# EAGLE schematic DMX_Transmiter v24 (EAGLE 9.7.0)
CNAME: DMX MASTER/SLAVE Transmitter; CREVISION: Marcel Tresanchez; DESIGNER: Guillermo Morancho Vela

## Sheet 1 of 2
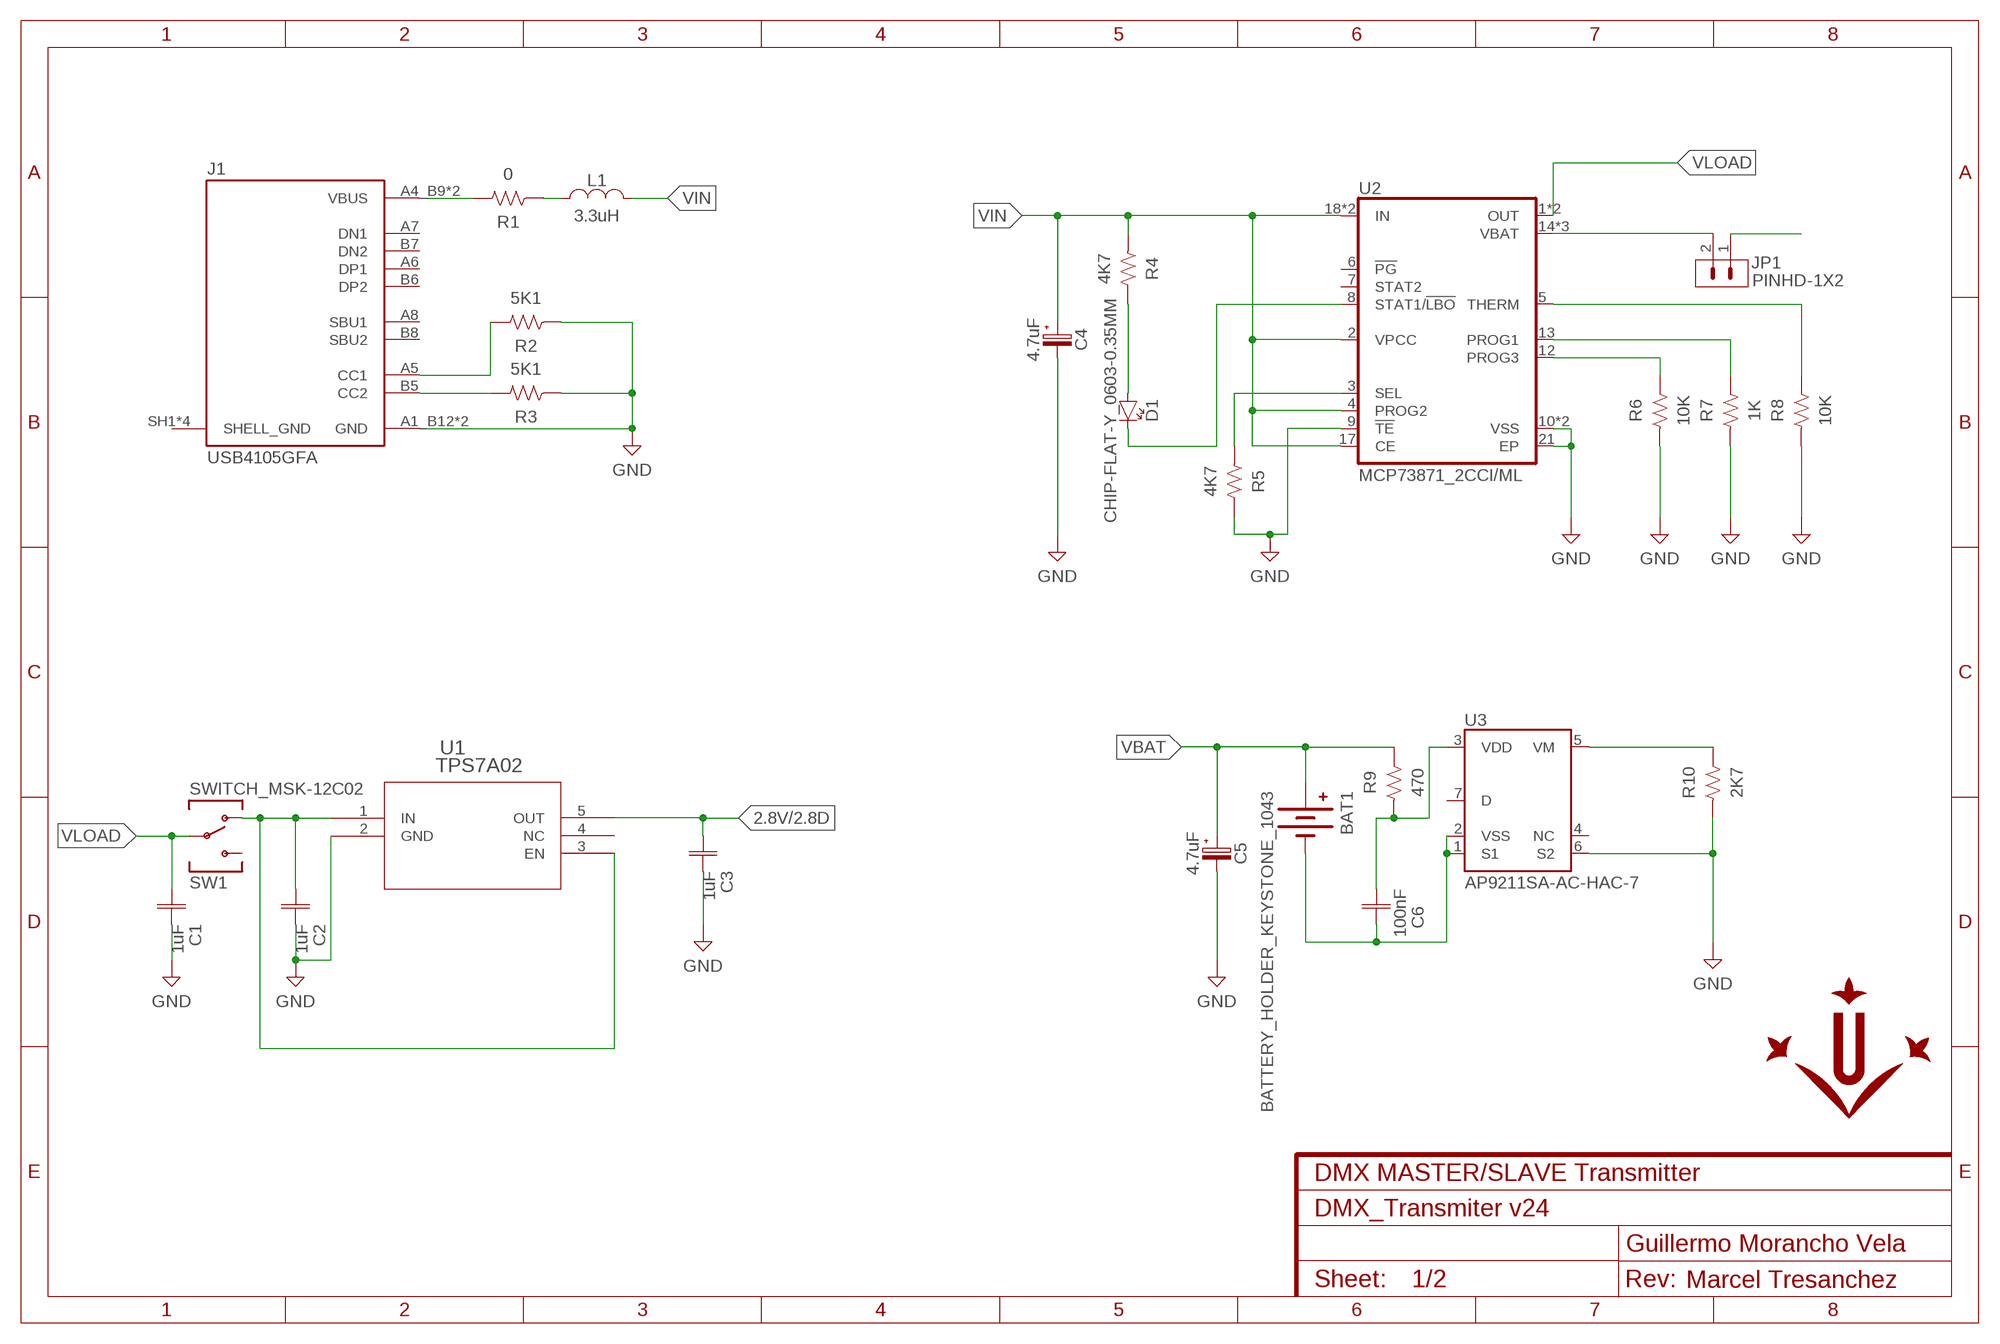
[diagram p0: schematic, sheet 1]

### Parts
BAT1  BATTERY_HOLDER_KEYSTONE_1043  [BH_KEYSTONE_1043]
C1  1uF  C_CHIP-0603(1608-METRIC)  [CAPC1608X85]
C2  1uF  C_CHIP-0603(1608-METRIC)  [CAPC1608X85]
C3  1uF  C_CHIP-0603(1608-METRIC)  [CAPC1608X85]
C4  4.7uF  C-POL_TANTALUM-1206(3216-METRIC)  [CAPMP3216X180N]
C5  4.7uF  C-POL_TANTALUM-1206(3216-METRIC)  [CAPMP3216X180N]
C6  100nF  C_CHIP-0603(1608-METRIC)  [CAPC1608X85]
D1  CHIP-FLAT-Y_0603-0.35MM  [LEDC1608X35N_FLAT-Y]
J1  USB4105GFA  [GCT-USB4105GFA]
JP1  PINHD-1X2  [1X02]
L1  3.3uH  L_CHIP-0603(1608-METRIC)  [INDC1608X95N]
LOGO1  UDL_LOGO_MED  [UDL_LOGO_MED]
R1  0  R-US_CHIP-0603(1608-METRIC)  [RESC1608X60]
R2  5K1  R-US_CHIP-0603(1608-METRIC)  [RESC1608X60]
R3  5K1  R-US_CHIP-0603(1608-METRIC)  [RESC1608X60]
R4  4K7  R-US_CHIP-0603(1608-METRIC)  [RESC1608X60]
R5  4K7  R-US_CHIP-0603(1608-METRIC)  [RESC1608X60]
R6  10K  R-US_CHIP-0603(1608-METRIC)  [RESC1608X60]
R7  1K  R-US_CHIP-0603(1608-METRIC)  [RESC1608X60]
R8  10K  R-US_CHIP-0603(1608-METRIC)  [RESC1608X60]
R9  470  R-US_CHIP-0603(1608-METRIC)  [RESC1608X60]
R10  2K7  R-US_CHIP-0603(1608-METRIC)  [RESC1608X60]
SW1  SWITCH_MSK-12C02  [MSK-12C02]
U1  TPS7A02  [SOT23_DBV_TEX]
U2  MCP73871_2CCI/ML  [QFN50P400X400X100-21N]
U3  AP9211SA-AC-HAC-7  [U-DFN2030-6]

### Nets
2.8V: C3.1 U1.5(OUT) ; also sheet 2
GND: C1.2 C2.2 C3.2 C4.2(-) C5.2(-) J1.A1_B12(GND) J1.B1_A12(GND) R2.1 R3.1 R5.2 R6.1 R7.1 R8.1 R10.1 U1.2(GND) U2.9(!TE) U2.10(VSS) U2.11(VSS) U2.21(EP) U3.6(S2) ; also sheet 2
N$1: J1.B5(CC2) R3.2
N$2: J1.A5(CC1) R2.2
N$3: J1.A4_B9(VBUS) J1.B4_A9(VBUS) R1.2
N$4: L1.1 R1.1
N$5: D1.A R4.2
N$11: D1.C U2.8(STAT1/!LBO)
N$12: R5.1 U2.3(SEL)
N$13: C6.1 R9.1 U3.3(VDD)
N$14: BAT1.2(-) C6.2 U3.1(S1) U3.2(VSS)
N$15: R8.2 U2.5(THERM)
N$16: R7.2 U2.13(PROG1)
N$17: R6.2 U2.12(PROG3)
N$18: R10.2 U3.5(VM)
N$19: JP1.2 U2.14(VBAT) U2.15(VBAT) U2.16(VBAT)
N$21: C2.1 SW1.O U1.1(IN) U1.3(EN)
VBAT: BAT1.1(+) C5.1(+) JP1.1 R9.2
VIN: C4.1(+) L1.2 R4.1 U2.2(VPCC) U2.4(PROG2) U2.17(CE) U2.18(IN) U2.19(IN)
VLOAD: C1.1 SW1.P U2.1(OUT) U2.20(OUT)
Unconnected: J1.A6(DP1) J1.A7(DN1) J1.A8(SBU1) J1.B6(DP2) J1.B7(DN2) J1.B8(SBU2) J1.SH1(SHELL_GND) J1.SH2(SHELL_GND) J1.SH3(SHELL_GND) J1.SH4(SHELL_GND) SW1.S U1.4(NC) U2.6(!PG) U2.7(STAT2) U3.4(NC) U3.7(D)

## Sheet 2 of 2
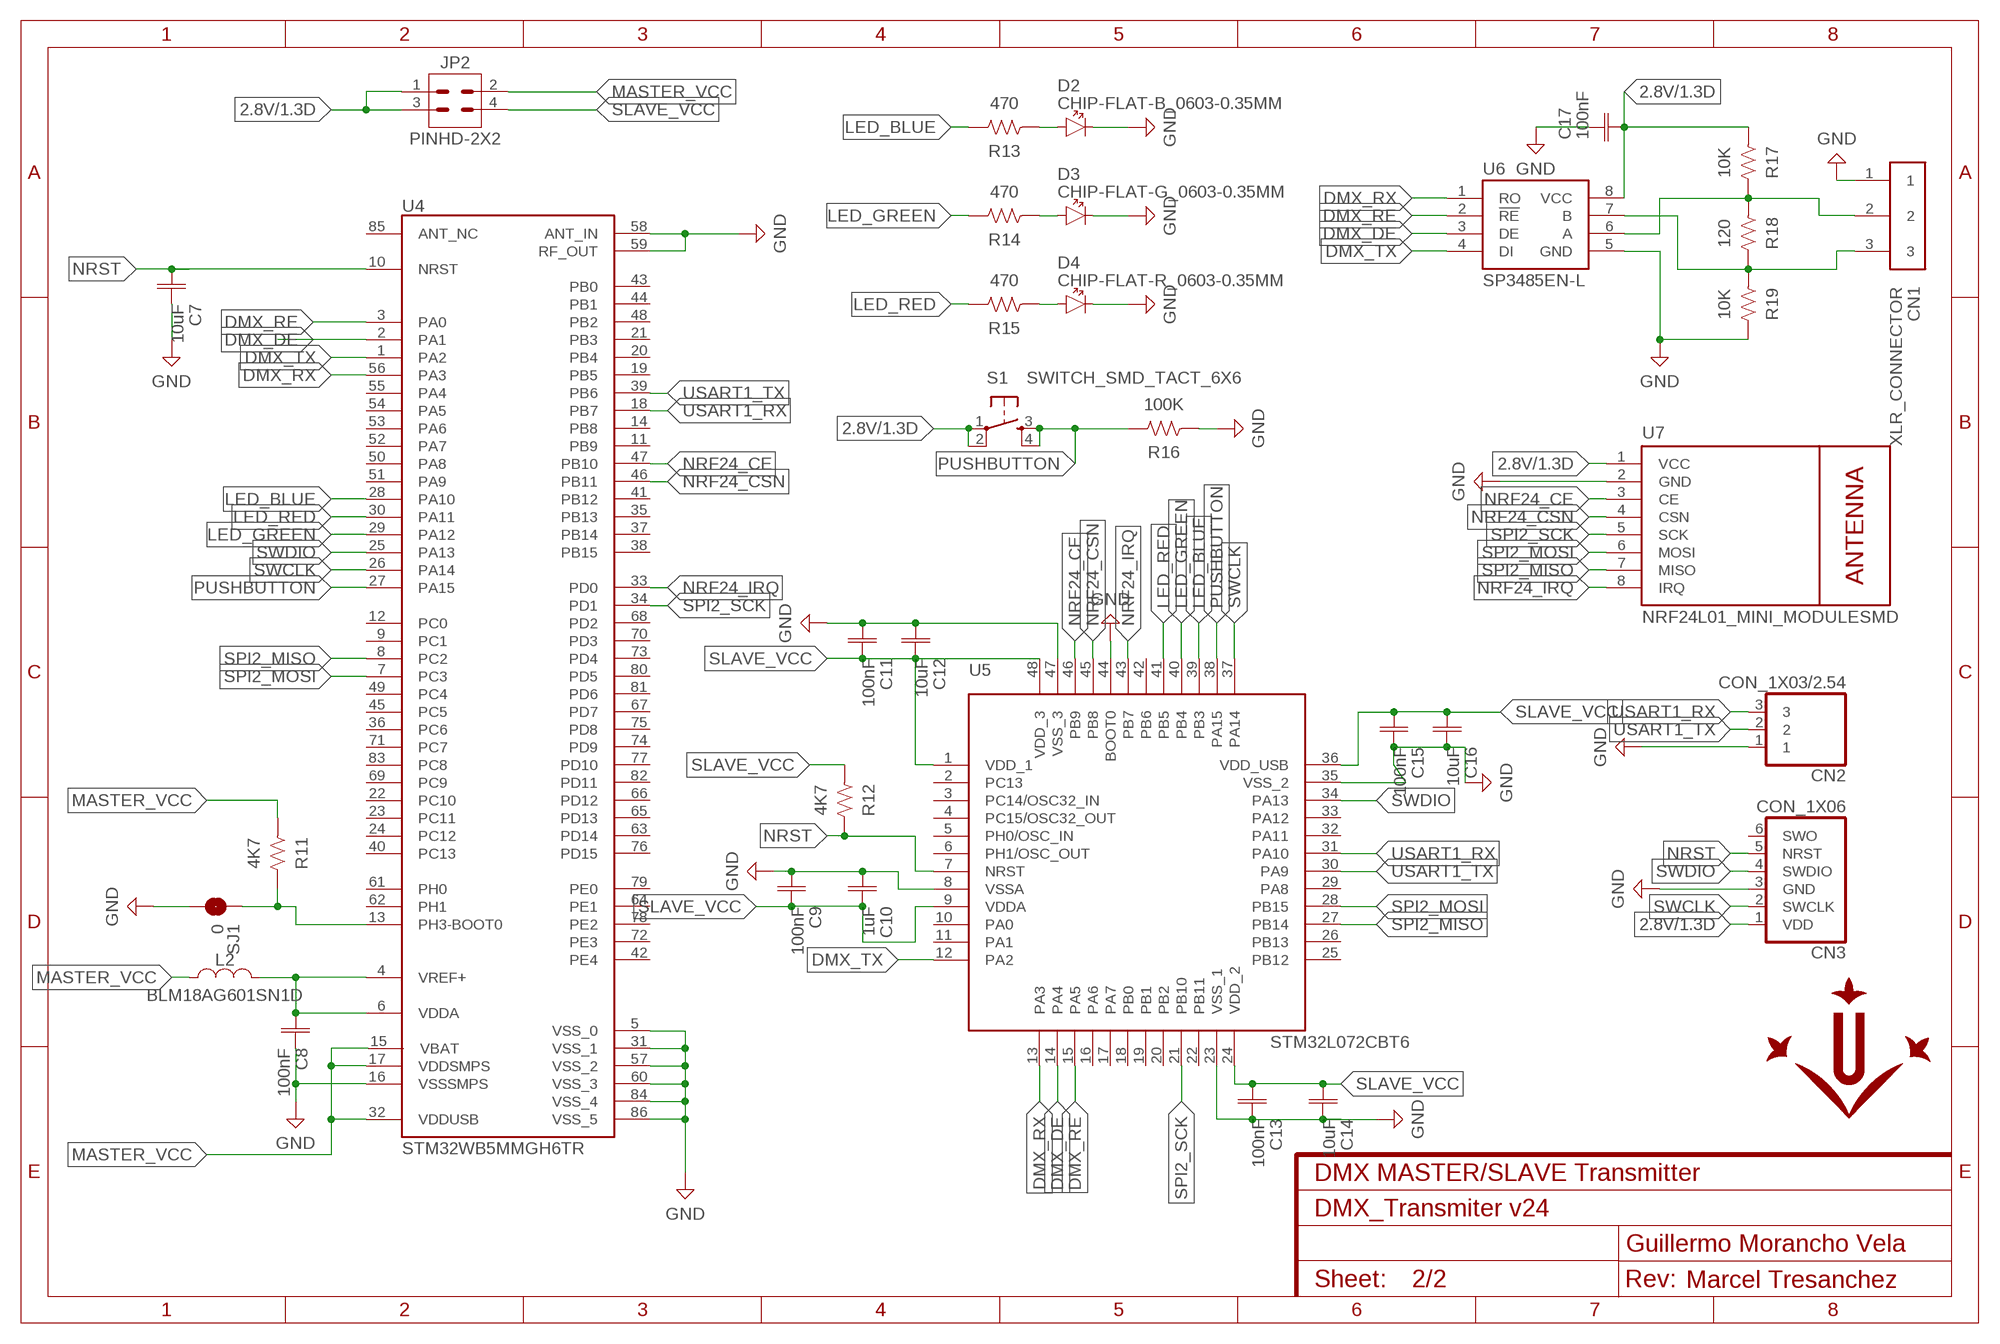
[diagram p1: schematic, sheet 2]

### Parts
C7  10uF  C_CHIP-0603(1608-METRIC)  [CAPC1608X85]
C8  100nF  C_CHIP-0603(1608-METRIC)  [CAPC1608X85]
C9  100nF  C_CHIP-0603(1608-METRIC)  [CAPC1608X85]
C10  1uF  C_CHIP-0603(1608-METRIC)  [CAPC1608X85]
C11  100nF  C_CHIP-0603(1608-METRIC)  [CAPC1608X85]
C12  10uF  C_CHIP-0603(1608-METRIC)  [CAPC1608X85]
C13  100nF  C_CHIP-0603(1608-METRIC)  [CAPC1608X85]
C14  10uF  C_CHIP-0603(1608-METRIC)  [CAPC1608X85]
C15  100nF  C_CHIP-0603(1608-METRIC)  [CAPC1608X85]
C16  10uF  C_CHIP-0603(1608-METRIC)  [CAPC1608X85]
C17  100nF  C_CHIP-0603(1608-METRIC)  [CAPC1608X85]
CN1  XLR_CONNECTOR  [XLR_PINS]
CN2  CON_1X03/2.54  [CON_1X03_2.54]
CN3  CON_1X06  CON_SWD_STM32_2.54  [CON_1X06_2.54]
D2  CHIP-FLAT-B_0603-0.35MM  [LEDC1608X35N_FLAT-B]
D3  CHIP-FLAT-G_0603-0.35MM  [LEDC1608X35N_FLAT-G]
D4  CHIP-FLAT-R_0603-0.35MM  [LEDC1608X35N_FLAT-R]
JP2  PINHD-2X2  [2X02]
L2  BLM18AG601SN1D  L_CHIP-0603(1608-METRIC)  [INDC1608X95N]
LOGO2  UDL_LOGO_SMALL  [UDL_LOGO_SMALL]
R11  4K7  R-US_CHIP-0603(1608-METRIC)  [RESC1608X60]
R12  4K7  R-US_CHIP-0603(1608-METRIC)  [RESC1608X60]
R13  470  R-US_CHIP-0603(1608-METRIC)  [RESC1608X60]
R14  470  R-US_CHIP-0603(1608-METRIC)  [RESC1608X60]
R15  470  R-US_CHIP-0603(1608-METRIC)  [RESC1608X60]
R16  100K  R-US_CHIP-0603(1608-METRIC)  [RESC1608X60]
R17  10K  R-US_CHIP-0603(1608-METRIC)  [RESC1608X60]
R18  120  R-US_CHIP-0603(1608-METRIC)  [RESC1608X60]
R19  10K  R-US_CHIP-0603(1608-METRIC)  [RESC1608X60]
S1  SWITCH_SMD_TACT_6X6  [SWITCH_6X6X7.3]
SJ1  0  SOLDER_JUMPER_SMT_2_S_OFF  [SOLDER_JUMPER_2_SMALL_OFF]
U4  STM32WB5MMGH6TR  [SIP-LGA86]
U5  STM32L072CBT6  [QFP50P900X900X160-48N]
U6  SP3485EN-L  [SOIC127P600X175-8N]
U7  NRF24L01_MINI_MODULESMD  [NRF24L01_MINI_MODULE]

### Nets
2.8V: C17.1 CN3.1(VDD) JP2.1 JP2.3 R17.1 S1.1 S1.2 U6.8(VCC) U7.1(VCC) ; also sheet 1
A: CN1.2 R17.2 R18.1 U6.6(A)
B: CN1.3 R18.2 R19.1 U6.7(B)
DMX_DE: U4.2(PA1) U5.14(PA4) U6.3(DE)
DMX_RE: U4.3(PA0) U5.15(PA5) U6.2(!RE)
DMX_RX: U4.56(PA3) U5.13(PA3) U6.1(RO)
DMX_TX: U4.1(PA2) U5.12(PA2) U6.4(DI)
GND: C7.2 C8.2 C9.1 C10.1 C11.1 C12.1 C13.2 C14.2 C15.2 C16.2 C17.2 CN1.1 CN2.1 CN3.3(GND) D2.C D3.C D4.C R16.1 R19.2 SJ1.2 U4.5(VSS_0) U4.16(VSSSMPS) U4.31(VSS_1) U4.57(VSS_2) U4.58(ANT_IN) U4.59(RF_OUT) U4.60(VSS_3) U4.84(VSS_4) U4.86(VSS_5) U5.8(VSSA) U5.23(VSS_1) U5.35(VSS_2) U5.44(BOOT0) U5.47(VSS_3) U6.5(GND) U7.2(GND) ; also sheet 1
LED_BLUE: R13.2 U4.28(PA10) U5.39(PB3)
LED_GREEN: R14.2 U4.29(PA12) U5.40(PB4)
LED_RED: R15.2 U4.30(PA11) U5.41(PB5)
MASTER_VCC: JP2.2 L2.1 R11.1 U4.15(VBAT) U4.17(VDDSMPS) U4.32(VDDUSB)
N$6: C8.1 L2.2 U4.4(VREF+) U4.6(VDDA)
N$7: R11.2 SJ1.1 U4.13(PH3-BOOT0)
N$8: D2.A R13.1
N$9: D3.A R14.1
N$10: D4.A R15.1
NRF24_CE: U4.47(PB10) U5.46(PB9) U7.3(CE)
NRF24_CSN: U4.46(PB11) U5.45(PB8) U7.4(CSN)
NRF24_IRQ: U4.33(PD0) U5.43(PB7) U7.8(IRQ)
NRST: C7.1 CN3.5(NRST) R12.2 U4.10(NRST) U5.7(NRST)
PUSHBUTTON: R16.2 S1.3 S1.4 U4.27(PA15) U5.38(PA15)
SLAVE_VCC: C9.2 C10.2 C11.2 C12.2 C13.1 C14.1 C15.1 C16.1 JP2.4 R12.1 U5.1(VDD_1) U5.9(VDDA) U5.24(VDD_2) U5.36(VDD_USB) U5.48(VDD_3)
SPI2_MISO: U4.8(PC2) U5.27(PB14) U7.7(MISO)
SPI2_MOSI: U4.7(PC3) U5.28(PB15) U7.6(MOSI)
SPI2_SCK: U4.34(PD1) U5.21(PB10) U7.5(SCK)
SWCLK: CN3.2(SWCLK) U4.26(PA14) U5.37(PA14)
SWDIO: CN3.4(SWDIO) U4.25(PA13) U5.34(PA13)
USART1_RX: CN2.3 U4.18(PB7) U5.31(PA10)
USART1_TX: CN2.2 U4.39(PB6) U5.30(PA9)
Unconnected: CN3.6(SWO) U4.9(PC1) U4.11(PB9) U4.12(PC0) U4.14(PB8) U4.19(PB5) U4.20(PB4) U4.21(PB3) U4.22(PC10) U4.23(PC11) U4.24(PC12) U4.35(PB13) U4.36(PC6) U4.37(PB14) U4.38(PB15) U4.40(PC13) U4.41(PB12) U4.42(PE4) U4.43(PB0) U4.44(PB1) U4.45(PC5) U4.48(PB2) U4.49(PC4) U4.50(PA8) U4.51(PA9) U4.52(PA7) U4.53(PA6) U4.54(PA5) U4.55(PA4) U4.61(PH0) U4.62(PH1) U4.63(PD14) U4.64(PE1) U4.65(PD13) U4.66(PD12) U4.67(PD7) U4.68(PD2) U4.69(PC9) U4.70(PD3) U4.71(PC7) U4.72(PE3) U4.73(PD4) U4.74(PD9) U4.75(PD8) U4.76(PD15) U4.77(PD10) U4.78(PE2) U4.79(PE0) U4.80(PD5) U4.81(PD6) U4.82(PD11) U4.83(PC8) U4.85(ANT_NC) U5.2(PC13) U5.3(PC14/OSC32_IN) U5.4(PC15/OSC32_OUT) U5.5(PH0/OSC_IN) U5.6(PH1/OSC_OUT) U5.10(PA0) U5.11(PA1) U5.16(PA6) U5.17(PA7) U5.18(PB0) U5.19(PB1) U5.20(PB2) U5.22(PB11) U5.25(PB12) U5.26(PB13) U5.29(PA8) U5.32(PA11) U5.33(PA12) U5.42(PB6)

## Library data of the parts
BAT1 = Marcel-SystemsIntegration-24-25:BATTERY_HOLDER_KEYSTONE_1043: KEYSTONE - 1043 - BATTERY HOLDER, 18650, TH Source: Datasheet <http://www.keyelco.com/product-pdf.cfm?p=919>; DESCRIPTION: KEYSTONE - 1043 - BATTERY HOLDER, 18650, TH; HEIGHT: 14.86mm; MANUFACTURER_NAME: Keystone Electronics; MANUFACTURER_PART_NUMBER: 1043; MOUSER_PART_NUMBER: 534-1043; MOUSER_PRICE-STOCK: https://www.mouser.co.uk/ProductDetail/Keystone-Electronics/1043?qs=%2F7TOpeL5Mz6j%2FnxeOA1rsg%3D%3D
C1-C3 C6-C17 = Capacitor:C: Capacitor - Generic; CATEGORY: Capacitor; PACKAGE_SIZE: 0603; PACKAGE_TYPE: Surface Mount; SUBCATEGORY: Ceramic Capacitors; TYPE: MLCC
C4 C5 = Capacitor:C-POL: Capacitor Polarised - Generic; CATEGORY: Capacitor; PACKAGE_SIZE: 1206; PACKAGE_TYPE: Surface Mount; SUBCATEGORY: Tantalum Capacitors; TYPE: Polymer Capacitors
CN1 = Library_projecte:XLR_CONNECTOR
CN2 = Marcel-SystemsIntegration-24-25:CON_1X03: 1x03 Connector
CN3 = Marcel-SystemsIntegration-24-25:CON_SWD_STM32: STM32 SWD Connector for programming
D1 = LED:CHIP-FLAT-Y: Yellow LED - Generic; CATEGORY: LED; COLOR: Yellow; DESCRIPTION: Yellow LED Indication 0603 (1608 Metric); PACKAGE_SIZE: 0603; PACKAGE_TYPE: Surface Mount; SUBCATEGORY: Chip LED; TYPE: Square with Flat Top
D2 = LED:CHIP-FLAT-B: Blue LED - Generic; CATEGORY: LED; COLOR: Blue; DESCRIPTION: Blue LED Indication 0603 (1608 Metric); PACKAGE_SIZE: 0603; PACKAGE_TYPE: Surface Mount; SUBCATEGORY: Chip LED; TYPE: Square with Flat Top
D3 = LED:CHIP-FLAT-G: Green LED - Generic; CATEGORY: LED; COLOR: Green; DESCRIPTION: Green LED Indication 0603 (1608 Metric); PACKAGE_SIZE: 0603; PACKAGE_TYPE: Surface Mount; SUBCATEGORY: Chip LED; TYPE: Square with Flat Top
D4 = LED:CHIP-FLAT-R: Red LED - Generic; CATEGORY: LED; COLOR: Red; DESCRIPTION: Red LED Indication 0603 (1608 Metric); PACKAGE_SIZE: 0603; PACKAGE_TYPE: Surface Mount; SUBCATEGORY: Chip LED; TYPE: Square with Flat Top
J1 = Marcel-SystemsIntegration-24-25:USB4105GFA: Conector USB, 5A, 48V, 240W, USB Tipo C, USB 2.0, Receptáculo, 16 Vías Farnell: Web <https://es.farnell.com/gct-global-connector-technology/usb4105-gf-a/usb-2-0-tipo-c-hembra-16pos-smt/dp/3588205> Farnell Code: 3588205 Download Symbol, Foorprint, 3D: Web <https://www.snapeda.com/parts/USB4105-GF-A/GCT/view-part/>; FARNELL_CODE: 3588205
JP1 = Connector:PINHD-1X2: Pin Header; CATEGORY: Connectors; DESCRIPTION: Header-Straight-2 Position; PACKAGE_TYPE: Through Hole; PITCH: 0.100" (2.54mm); SUBCATEGORY: Headers; TYPE: Male Pins
JP2 = Connector:PINHD-2X2: Pin Header; CATEGORY: Connectors; DESCRIPTION: Header-Straight-2x2 Position; PACKAGE_TYPE: Through Hole; PITCH: 0.100" (2.54mm); SUBCATEGORY: Headers; TYPE: Male Pins
L1 L2 = Inductor:L: Inductor Fixed - Generic; CATEGORY: Inductors; DESCRIPTION: Chip 1.60 X 0.80 X 0.95 mm body 0603(1608-METRIC); PACKAGE_SIZE: 0603; PACKAGE_TYPE: Surface Mount
LOGO1 LOGO2 = Marcel-SystemsIntegration-24-25:UDL_LOGO: Universitat de Lleida Logo Universitat de Lleida logo
R1-R19 = Resistor:R-US: Resistor Fixed - ANSI; CATEGORY: Resistors; DESCRIPTION: Chip Resistor 1.60 X 0.82 X 0.60 mm body 0603(1608-METRIC) Package; PACKAGE_SIZE: 0603; PACKAGE_TYPE: Surface Mount
S1 = Marcel-SystemsIntegration-24-25:SWITCH_SMD_TACT_6X6: 6x6 Momentary Panel PCB SMD SMT Push Button SPST Tactile Tact Switch OMRON - B3FS-1000P SWITCH TACT Switch (SMD); OC_EBAY: https://www.ebay.es/itm/183740462435; RS: 682-1254
SJ1 = Marcel-SystemsIntegration-24-25:SOLDER_JUMPER_SMT_2: SMD solder JUMPER
SW1 = Marcel-SystemsIntegration-24-25:SWITCH_MSK-12C02: MSK-12C02 Surface Mount Right Angle Switch (SPDT) 1P2T Side-actuated SPDT slide switch, as used on the Arduino Pro Surface Mount Package. 1.4mm Height. Horizontal Actuator . Single Pole, TwoPositions. Rating = 0.3A / 6Vdc. Contact Resistance = 70mΩ MAX. Dielectric Strength= AC 500V for 1 min. Life Test = 10,000 Cycles. Other names: - Bailey Products MSK-12C02 - Sparkfun COM-10860 - SWCH-10651 - KPS-1290; EBAY: https://www.ebay.es/itm/50pcs-MSK-12C02-2-Position-7pins-1P2T-Miniature-Horizontal-Slide-Switch/360895616269?hash=item54070e150d:g:IJoAAOSwxCxT4jcO; PROD_ID: SWCH-10651
U1 = Library_projecte:TPS7A02*: TPS7A02 200mA, nanopower-IQ (25 nA), low-dropout (LDO) voltage regulator with enable. Source: Datasheet <https://www.ti.com/lit/ds/symlink/tps7a02.pdf?ts=1741245153204>; COPYRIGHT: Copyright (C) 2025 Ultra Librarian. All rights reserved.; MANUFACTURER_PART_NUMBER: TPS7A0212PDBVR; MFR_NAME: Texas Instruments
U2 = Marcel-SystemsIntegration-24-25:MCP73871: MCP73871 1-cell Li-Ion battery charge controller with load sharing system.; MANUFACTURER: MICROCHIP; MANUFACTURER_ID: MCP73871- 2CCI/ML; SOURCE: Farnell: 1642489
U3 = Marcel-SystemsIntegration-24-25:AP9211: AP9211 1-cell Li-Ion battery protection chip with dual N-CH MOSFET; MANUFACTURER: Diodes Incorporated; MANUFACTURER_ID: AP9211SA-ACHAC- 7; SOURCE: Mouser; SOURCE_ID: 621- AP9211SA-ACHAC7
U4 = Marcel-SystemsIntegration-24-25:STM32WB5MMGH6TR: STM32WB5MMG STMicroelectronics STM32WB5MMG 2.4GHz Wireless Module; DESCRIPTION: 802.15.4, Bluetooth Bluetooth v5.0, Thread, Zigbee® Transceiver Module 2.4GHz Integrated, Chip Surface Mount; MF: STMicroelectronics; MP: STM32WB5MMGH6TR; PACKAGE: LFLGA-86 STMicroelectronics; PRICE: None; PURCHASE-URL: https://pricing.snapeda.com/search/part/STM32WB5MMGH6TR/?ref=eda
U5 = Marcel-SystemsIntegration-24-25:STM32L072CBT6: ARM Microcontrollers - MCU 16/32-BITS MICROS Source: Datasheet <https://www.st.com/resource/en/datasheet/stm32l072cb.pdf>; DESCRIPTION: ARM Microcontrollers - MCU 16/32-BITS MICROS; HEIGHT: 1.6mm; MANUFACTURER_NAME: STMicroelectronics; MANUFACTURER_PART_NUMBER: STM32L072CBT6; MOUSER_PART_NUMBER: 511-STM32L072CBT6; MOUSER_PRICE-STOCK: https://www.mouser.co.uk/ProductDetail/STMicroelectronics/STM32L072CBT6?qs=dTJS0cRn7ojAyJ%2FoC1SuOQ%3D%3D
U6 = Marcel-SystemsIntegration-24-25:SP3485: RS-485 Interface IC 3.3 V powered, up to 10 Mbps RS-485 transceiver; DESCRIPTION: RS-485 Interface IC 3.3 V powered, up to 10 Mbps RS-485 transceiver; HEIGHT: 1.75mm; MANUFACTURER_NAME: MaxLinear; MANUFACTURER_PART_NUMBER: SP3485
U7 = Marcel-SystemsIntegration-24-25:NRF24L01_MINI_MODULE: 2.4 GHz Wireless Module based on NRF24L01 chip https://es.aliexpress.com/item/32842054029.html https://www.satistronics.com/shop/1941167-mini-nrf24l01-smd-1-27mm-wireless-transceiver-module-small-size-6466#attr=